# Altium schematic sheet Schematic.SchDoc
size 431 x 279 mm; SheetNumber: 1; SheetTotal: 4; ENG_APP_DATE: --/--/--; DSN_APP_DATE: --/--/--; CHK_APP_DATE: --/--/--
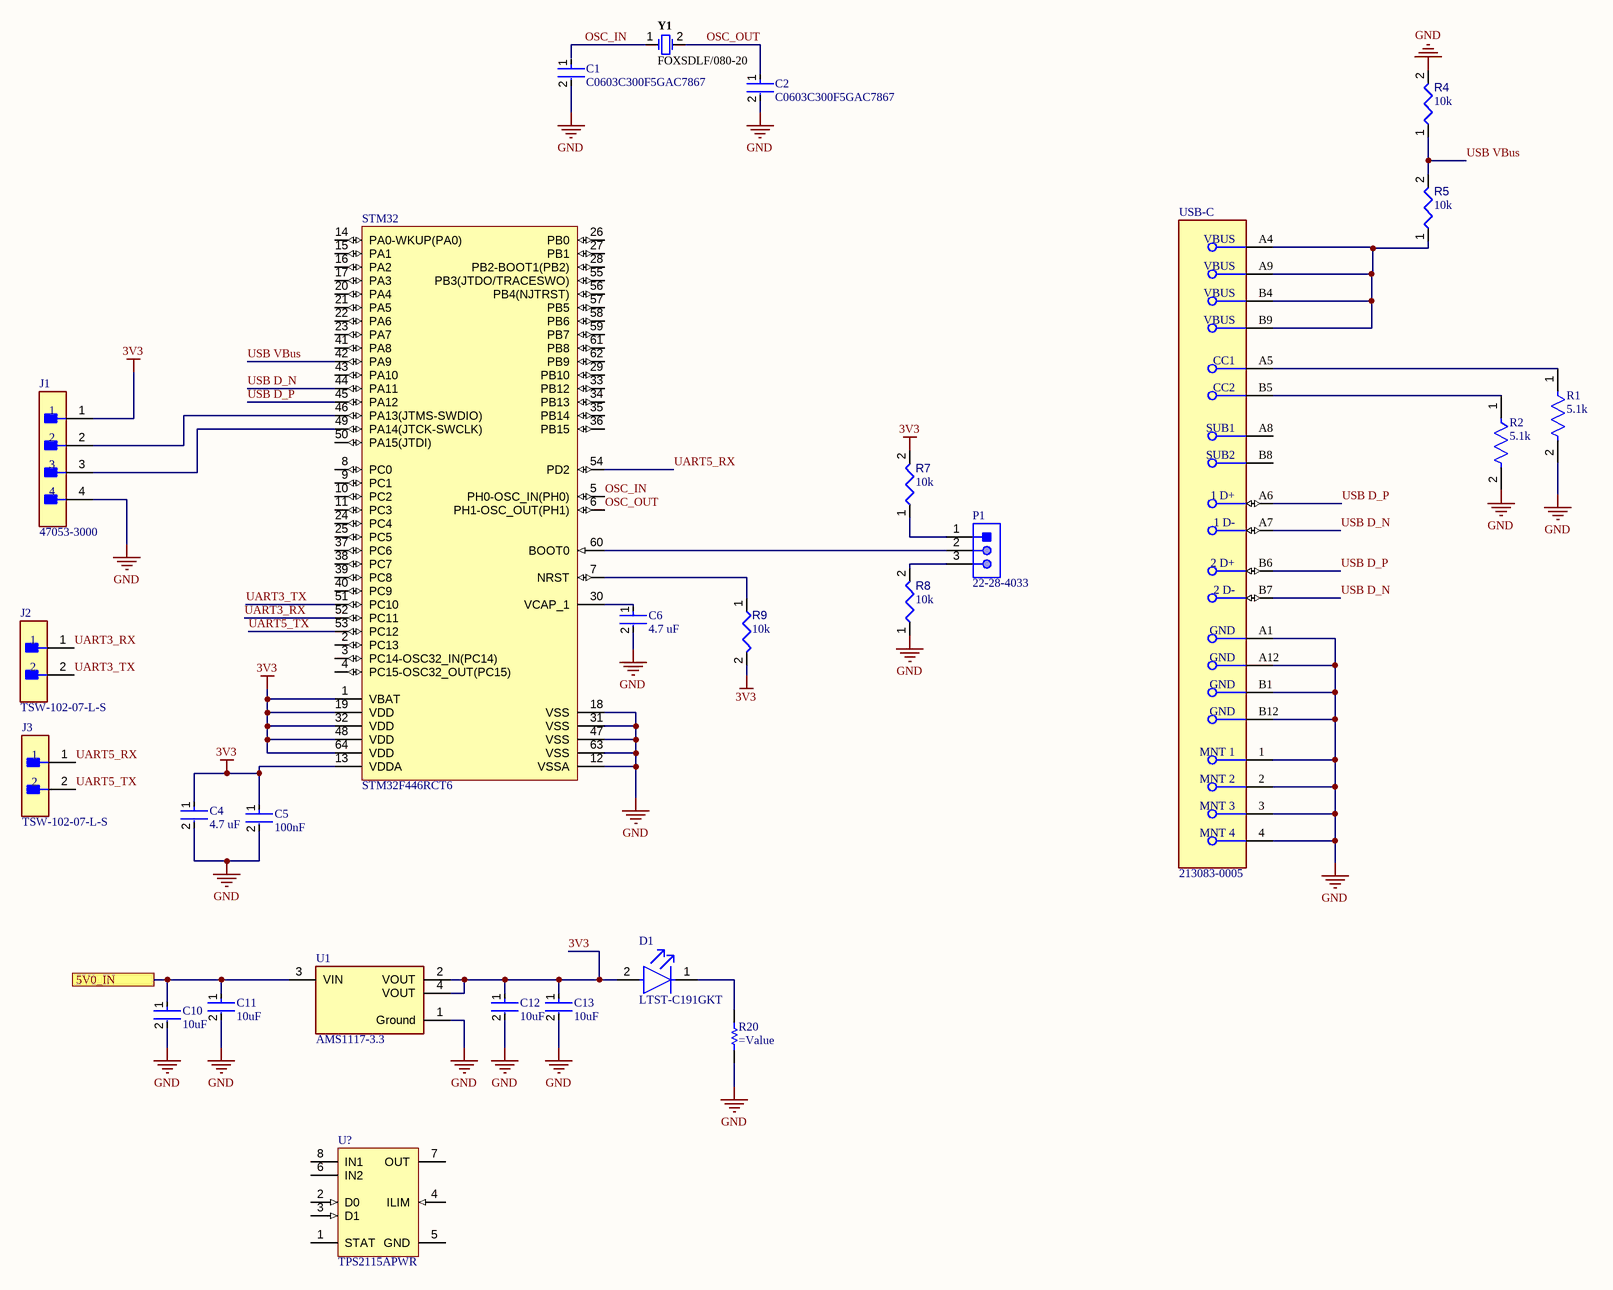
[diagram p0: Schematic.SchDoc]

## Parts
C1  C0603C300F5GAC7867  [FP-C0603C-CF-MFG]
C2  C0603C300F5GAC7867  [FP-C0603C-CF-MFG]
C4  4.7 uF  [FP-CC0603-DA-MFG]
C5  100nF  [FP-CGA2B-IPC_C]
C6  4.7 uF  [FP-CC0603-DA-MFG]
C10  10uF  [FP-GRM21B-0_1-MFG]
C11  10uF  [FP-GRM21B-0_1-MFG]
C12  10uF  [FP-GRM21B-0_1-MFG]
C13  10uF  [FP-GRM21B-0_1-MFG]
D1  LTST-C191GKT  [FP-LTST-C191GKT-MFG]
J1  47053-3000  [FP-47053-3000-MFG]
J2  TSW-102-07-L-S  [FP-TSW-102-07-L-S-MFG]
J3  TSW-102-07-L-S  [FP-TSW-102-07-L-S-MFG]
P1  22-28-4033  [MOLX-22-28-4033_V]
R1  5.1k  [FP-MCT0603-IPC_B]
R2  5.1k  [FP-MCT0603-IPC_B]
R4  value 10k  [RESC0402(1005)_L]  (hidden comment: 10KR2F)
R5  value 10k  [RESC0402(1005)_L]  (hidden comment: 10KR2F)
R7  value 10k  [RESC0402(1005)_L]  (hidden comment: 10KR2F)
R8  value 10k  [RESC0402(1005)_L]  (hidden comment: 10KR2F)
R9  value 10k  [RESC0402(1005)_L]  (hidden comment: 10KR2F)
R20  (no value)  [RESC3225X60X45ML20T20]
STM32  STM32F446RCT6  [STM-LQFP64_L]
U1  AMS1117-3.3  [FP-AMS1117-IPC_C]
U?  TPS2115APWR  [PW0008A_N]
USB-C  213083-0005  [FP-2130830005-MFG]
Y1  FOXSDLF/080-20  [FOX-HC49SDLF_V]

## Ports
5V0_IN

## Nets
3V3: C4.1 C5.1 C12.1 C13.1 D1.2(A) J1.1 R7.2 R9.2 STM32.1(VBAT) STM32.13(VDDA) STM32.19(VDD) STM32.32(VDD) STM32.48(VDD) STM32.64(VDD) U1.2(VOUT) U1.4(VOUT)
GND: C1.2 C2.2 C4.2 C5.2 C6.2 C10.2 C11.2 C12.2 C13.2 J1.4 R1.2 R2.2 R4.2 R8.1 R20.1 STM32.12(VSSA) STM32.18(VSS) STM32.31(VSS) STM32.47(VSS) STM32.63(VSS) U1.1(Ground) USB-C.1(MNT_1) USB-C.2(MNT_2) USB-C.3(MNT_3) USB-C.4(MNT_4) USB-C.A1(GND) USB-C.A12(GND) USB-C.B1(GND) USB-C.B12(GND)
5V0_IN: C10.1 C11.1 U1.3(VIN) ; port 5V0_IN
OSC_IN: STM32.5(PH0-OSC_IN(PH0)) Y1.1
OSC_OUT: C2.1 STM32.6(PH1-OSC_OUT(PH1)) Y1.2
UART3_RX: J2.1 STM32.52(PC11)
UART3_TX: J2.2 STM32.51(PC10)
UART5_RX: J3.1 STM32.54(PD2)
UART5_TX: J3.2 STM32.53(PC12)
USB D_N: STM32.44(PA11) USB-C.A7(1_D-) USB-C.B7(2_D-)
USB D_P: STM32.45(PA12) USB-C.A6(1_D+) USB-C.B6(2_D+)
USB VBus: R4.1 R5.2 STM32.42(PA9)
NetC6_1: C6.1 STM32.30(VCAP_1)
NetD1_1: D1.1(C) R20.2
NetJ1_2: J1.2 STM32.46(PA13(JTMS-SWDIO))
NetJ1_3: J1.3 STM32.49(PA14(JTCK-SWCLK))
NetP1_1: P1.1 R7.1
NetP1_2: P1.2 STM32.60(BOOT0)
NetP1_3: P1.3 R8.2
NetR1_1: R1.1 USB-C.A5(CC1)
NetR2_1: R2.1 USB-C.B5(CC2)
NetR5_1: R5.1 USB-C.A4(VBUS) USB-C.A9(VBUS) USB-C.B4(VBUS) USB-C.B9(VBUS)
NetR9_1: R9.1 STM32.7(NRST)

Not connected (* = marked no-connect by the designer): C1 1; STM32 2(PC13) 3(PC14-OSC32_IN(PC14)) 4(PC15-OSC32_OUT(PC15)) 8(PC0) 9(PC1) 10(PC2) 11(PC3) 14(PA0-WKUP(PA0)) 15(PA1) 16(PA2) 17(PA3) 20(PA4) 21(PA5) 22(PA6) 23(PA7) 24(PC4) 25(PC5) 26(PB0) 27(PB1) 28(PB2-BOOT1(PB2)) 29(PB10) 33(PB12) 34(PB13) 35(PB14) 36(PB15) 37(PC6) 38(PC7) 39(PC8) 40(PC9) 41(PA8) 43(PA10) 50(PA15(JTDI)) 55(PB3(JTDO/TRACESWO)) 56(PB4(NJTRST)) 57(PB5) 58(PB6) 59(PB7) 61(PB8) 62(PB9); U? 1(STAT) 2(D0) 3(D1) 4(ILIM) 5(GND) 6(IN2) 7(OUT) 8(IN1); USB-C A8(SUB1) B8(SUB2)

## Notes on the sheet
- DWG. NO.
- REV.
- SHT.
- THIS DOCUMENT AND THE DATA DISCLOSED HEREIN OR HEREWITH IS THE PROPERTY OF ALTIUM LIMITED AND MAY BE FREELY DISTRIBUTED IN WHOLE. NO RIGHTS ARE RESERVED OR EXPRESS OR IMPLIED WARANTEE GIVEN.
- REVISION
- DESCRIPTION
- DATE
- APPROVED
- ENG:
- APPROVALS
- PROJECT
- DSN:
- CHK:
- REFERENCE DOCUMENTS
- PROJECT REVISION:
- TITLE
- DOCUMENT REVISION:
- DESIGN ITEM:
- BOM:
- FAB DWG:
- PCB DWG:
- ASSY DWG:
- SCALE:
- SIZE
- B
- CAGE CODE
- FILE NAME
- DWG NO.
- SHEET
- OF
- REV

## Library data of the parts
C1 C2 = CMP-03020-022157-1: Cap Ceramic 30pF 50V C0G 1% SMD 0603 125°C Paper T/R; Manufacturer: KEMET; Automotive Grade: Grade 1; Tolerance: 0.01; Temperature Coefficient: 30ppm/°C; Manufacturer Part Number: C0603C300F5GAC7867; Automotive: Yes; Package: C0603C-CF; Octopart: https://octopart.com/c0603c300f5gac7867-kemet-1596617; Capacitance: 30 pF; Category: Cap; ComponentLink2Description: Datasheet; Device Class L2: Capacitors; Device Class L3: Ceramic Capacitors; RoHS: TRUE; Voltage Rating: 50 V; Height: 0.87mm; ComponentLink2URL: https://api.kemet.com/component-edge/download/datasheet/C0603C100J5GACAUTO.pdf; Value: 30 pF; Device Class L1: Passive Components; Temperature Characteristic: C0G; Temperature: -55°C to +125°C; Digikey Description: Cap Ceramic 30pF 50V C0G 1% SMD 0603 125°C Paper T/R; Temperature Range Low: -55°C; Temperature Range High: +125°C; Lead Free: Yes; Material: Ceramic
C4 C6 = CMP-2000-06074-2: CAP CER 4.7UF 10V X5R 0603; Manufacturer Part Number: CC0603KRX5R6BB475; Manufacturer: YAGEO; Temperature Coefficient: 15%; Tolerance: 0.1; Material: Ceramic; Voltage Rating: 10 V; ComponentLink2URL: http://www.yageo.com/documents/recent/UPY-GPHC_X7R_6.3V-to-50V_18.pdf; Package: CC0603-DA; Temperature Range High: +125°C; Category: Cap; ComponentLink2Description: Datasheet; Lead Free: Yes; Mouser Description: 4.7µF Surface Mount, MLCC 0603 (1608 Metric) Package Ceramic Capacitors; Device Class L2: Capacitors; Temperature Characteristic: X5R; Voltage: 10 V; RoHS: TRUE; Octopart: https://octopart.com/cc0603krx5r6bb475-yageo-9292507; Automotive: No; Height: 0.9mm; Temperature: -55°C to +125°C; Temperature Range Low: -55°C; Value: 4.7 uF; Digikey Description: CAP CER 4.7UF 10V X5R 0603; Device Class L1: Passive Components; Capacitance: 4.7 uF; Footprint Url: http://www.yageo.com/exep/pages/download/literatures/UPY-C_GEN_24.pdf; Device Class L3: Ceramic Capacitors
C5 = CMP-08246-000862-1: Cap Ceramic 100nF 50V X7R 10% Pad SMD 0402 +125°C Automotive T/R; Case Code (Metric): 1005; Features: Soft Termination; Case/Package: 0402; Capacitance: 100nF; Length: 0.039inch; Tolerance: 10%; Thickness: 0.024inch; Lead Free: Lead Free; Mount: Surface Mount; Max Operating Temperature: 125°C; Width: 0.02inch; Voltage Rating: 50V; Case Code (Imperial): 0402; Ratings: AEC-Q200; Min Operating Temperature: -55°C; Packaging: Cut Tape
C10-C13 = CMP-06035-020598-1: =value; Tolerance: 10%; Voltage Rating (DC): 16V; Length: 2mm; Depth: 1.25mm; Packaging: Tape and Reel; Lead Free: Lead Free; Min Operating Temperature: -25°C; Case/Package: 0805; Max Operating Temperature: 85°C; Thickness: 1.25mm; Capacitance: 10uF
D1 = CMP-22017-000029-1: LED GREEN CLEAR CHIP SMD; Power Dissipation: 100mW; Lens Color: Colorless; Number of Elements: 1; Dominant Wavelength: 569nm; Forward Voltage: 2.1V; Forward Current: 30mA; Test Current: 20mA; Viewing Angle: 130°; Wavelength: 565nm; Luminous Intensity: 12mcd; Reverse Voltage: 5V; Case/Package: 0603; Package Quantity: 1; Illumination Color: Green; Lens Style: Clear; Lens Transparency: Clear; Depth: 0.8mm; Power Rating: 100mW; Width: 0.8mm; Height: 0.55mm; Radiation Hardening: No; Case Code (Imperial): 0603; Number of Pins: 2; Length: 1.6mm; Case Code (Metric): 1608; Max Operating Temperature: 85°C; Color: Green; Packaging: Tape and Reel; Mount: Surface Mount; Min Operating Temperature: -55°C; Lead Free: Lead Free; Number of LEDs: 1
J1 = CMP-04776-000447-1: CONN HEADER VERT 4POS 2.54MM; Glow Wire Compliant: Non-compliant; Voltage Rating: 250V; Current Rating: 4A; Number of Circuits: 4; Gender: Male; Orientation: Straight; Packaging: Bulk; Series: 47053; RoHS Compliant: Yes; Termination: Through Hole; Contact Plating: Tin; Mount: Through Hole; Number of Rows: 1; Pitch: 2.54mm; Halogen Free: Low Halogen; Number of Contacts: 4; Min Operating Temperature: 0°C; Package Quantity: 12000; Contact Material: Copper Alloy; Max Operating Temperature: 75°C; REACH SVHC: No SVHC; Number of Positions: 4
J2 J3 = CMP-02766-001428-1: CONN HEADER VERT 2POS 2.54MM; Voltage Rating: 550V; Current Rating: 7.6A; Gender: Male; Number of Contacts: 2; Connector Type: Male Pin; Radiation Hardening: No; Orientation: Straight; Contact Plating: Gold; Max Operating Temperature: 125°C; Mount: Through Hole; Package Quantity: 1; Number of Rows: 1; Housing Material: Polyester; RoHS Compliant: Yes; Length: 5.08mm; Max Voltage Rating (AC): 550V; Pitch: 2.54mm; Packaging: Bulk; Depth: 2.54mm; Termination: Solder; Min Operating Temperature: -55°C; Housing Color: Black; Lead Free: Lead Free; Color: Black; Number of Positions: 2; Width: 2.54mm; Max Current Rating: 7.6A; REACH SVHC: No SVHC; Contact Material: Bronze; Contact Mating Length: 0.23inch; Series: TSW; Contact Type: Male Pin
P1 = CMP-1676-00001-5: Male Header, Pitch 2.54 mm, 1 x 3 Position, Height 8.38 mm, Tail Length 3.18 mm, RoHS, Bulk; Manufacturer: Molex; Rows: 1; Voltage Rating: 250 V; Current Rating: 4 A; Min Operating Temperature: 0 degC; Lead Pitch: 0.1 inch; Packaging: Bulk; Contact Finish: Gold; RoHSCompliant: true; Contact Material: Brass; PackageReference: 22-28-4033; REACH SVHC: Unknown; PackageDescription: Male Header, Pitch 2.54 mm, 1 x 3 Position, Height 8.38 mm, Tail Length 3.18 mm; ComponentLink2URL: http://www.molex.com/pdm_docs/sd/022284033_sd.pdf; Height: 8.38 mm; Mounting Technology: Through Hole; ComponentLink1Description: Manufacturer URL; Length: 7.62 mm; Mount: Through Hole; DatasheetVersion: Rev. G, 01/2012; Max Operating Temperature: 75 degC; ComponentLink2Description: Datasheet; Colour: Black; Pins: 3; Contact Plating: Gold; Package Quantity: 1; ComponentLink1URL: http://www.molex.com/
R1 R2 = CMP-02407-010205-1: RES SMD 100 OHM 1% 1/8W 0603; Resistance: 5.1kR; Tolerance: 0.1%; Temperature Coefficient: 25ppm/°C; Max Operating Temperature: 125°C; Radiation Hardening: No; Composition: Thin Film; Height: 450um; Lead Free: Lead Free; Contact Plating: Tin; Length: 1.55mm; Width: 850um; Case/Package: 0603; Min Operating Temperature: -55°C
R4 R5 R7-R9 = CMP-009-00066-2: 10K 0.063W 1% 0402 (1005 Metric)  SMD; Power: 63mW; Case/Package: 0402; Mounting Technology: SMT; Pins: 2; Tolerance: 1%
R20 = CMP-2005-00707-1: Part Number: CRCW1210330RJNTA; Manufacturer: Vishay Dale
STM32 = CMP-0243-00216-1: ARM Cortex-M4 32-bit MCU+FPU, 256 KB Flash, 128 KB Internal RAM, 50 I/Os, 64-Pin LQFP, -40 to 85 degC, Tray; Operating Frequency(F) (Processor speed) (MHz): 180; Internal RAM Size (kB): 128; I/Os (High Current): 50; FLASH Size (Prog) (kB): 256; D/A Converter: 2; Supply Voltage(Vcc) min (V): 1.7; Mounting Technology: Surface Mount; DatasheetVersion: Rev. 6; ComponentLink1URL: http://www.st.com/; Package Description: LQFP64; ComponentLink1Description: Manufacturer URL; Packing: Tray; ComponentLink2Description: Datasheet; Core: ARM Cortex-M4; Package Reference: 64-Pin Low-profile Quad Flat Package, Body 10 x 10 mm, Pitch 0.5 mm; ComponentLink2URL: http://www.st.com/st-web-ui/static/active/en/resource/technical/document/datasheet/DM00141306.pdf
U1 = CMP-209535-000001-1: LDO Voltage Regulators 1A, 3.3V; Manufacturer: Advanced Monolithic Systems; Dropout Voltage: 1.1V; Output Type: Fixed; Nominal Supply Current: 5mA; Max Power Dissipation: 1.2W; Max Supply Voltage: 15V; Number Of Outputs: 1; Standoff Height: 0.64mm; Max Junction Temp: +125°C; Height: 1.8mm; Package: AMS1117; Device Class L2: Power Management ICs; ComponentLink2Description: Datasheet; ComponentLink2URL: http://www.advanced-monolithic.com/pdf/ds1117.pdf; Category: IC; RoHS: TRUE; Automotive: No; Device Class L1: Integrated Circuits (ICs); Output Current: 1A; Device Class L3: Voltage Regulators - Linear; Temperature: -40°C to +125°C; Output Voltage: 3.3V; Manufacturer Part Number: AMS1117-3.3; Temperature Range Low: -40°C; Octopart: https://octopart.com/ams1117-3.3-advanced+monolithic+systems-25899300; Lead Free: Yes; Ipc Land Pattern Name: SOT229P700X180-4; Temperature Range High: +125°C
U? = CMP-0339-00018-2: Dual In / Single Out Autoswitching Power Mux, 2.8 to 5.5 V, -40 to 85 degC, 8-pin TSSOP (PW), Green (RoHS & no Sb/Br); Manufacturer: Texas Instruments; SubFamily: Power Multiplexer (MUX); IN2 rDS(on)(Typ)(Ohms): 0.084; Number of Inputs: 2; IN1, IN2 Input Voltage(Max)(V): 5.5; IN1, IN2 Input Voltage(Min)(V): 2.8; IN1 rDS(on)(Typ)(mOhm): 84; IN2 Output Current(Max)(A): 1.25; PackageDescription: 8-Pin Plastic Thin Small Outline Package 3 x 4.4 mm Body ,0.65 mm Pitch; PackageVersion: revG, Feb-2011; ComponentLink1Description: Datasheet; Mounting Technology: Surface Mount; PartNumber: TPS2115APWR; DatasheetVersion: SBVS044F; Eco-Plan: Green (RoHS & no Sb/Br); Code_JEDEC: MO-153; PackageReference: PW0008A; IN1 Output Current(Max)(A): 1.25; ComponentLink1URL: http://www.ti.com/general/docs/lit/getliterature.tsp?genericPartNumber=TPS2115A&fileType=pdf
USB-C = CMP-04767-000030-2: CONN RCP USB2.0 TYP C 24P SMD RA; NexarPartId: 114105384; Current Rating: 5A; Number of Contacts: 16; Voltage Rating: 30V; Gender: Receptacle; Min Operating Temperature: -40°C; USB Standard: USB 2.0; Max Operating Temperature: 85°C; Contact Material: Gold, Nickel; Schedule B: 8536695050, 8536695050; Country of Origin: CN
Y1 = CMP-2100-03639-1: Resistance Weld Crystal, 8 MHz, +/- 30 ppm, -20 to 70 degC, 2-Pin SMD, RoHS, Tape and Reel; Manufacturer: FOX Electronics; Series Resistance: 80Ohm; Frequency: 8MHz; Load Capacitance: 20pF; Tolerance: 50ppm; Frequency Tolerance: 30ppm; Datasheet URL: http://www.foxonline.com/pdfs/hc49sdlf.pdf; Package Reference: HC49SDLF; Height: 4.5mm; Mount: SurfaceMount; Packaging: TapeandReel; Length: 11.7mm; Termination: SMD/SMT; Number of Pins: 2; Depth: 5mm; Min Operating Temperature: -20degC; Package Quantity: 1000; RoHSCompliant: True; Lead Free: LeadFree; Width: 5mm; Case/Package: SMD/SMT; Manufacturer URL: http://www.foxonline.com/; Max Operating Temperature: 70degC; REACH SVHC: NoSVHC; Datasheet Version: 42064.0; Package Description: 2-Pin Surface Mount Device, Body 5 x 11.7 mm; Frequency Stability: 50ppm; ESR (Equivalent Series Resistance): 80Ohm; Radiation Hardening: No